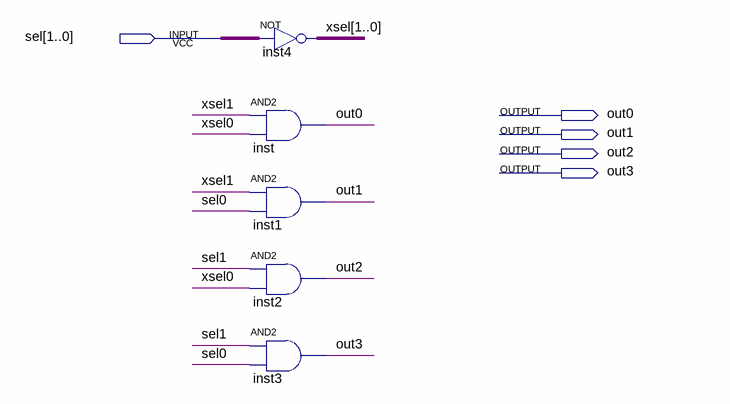
[diagram p0: schematic sheet]
// Quartus schematic pfs_decod2x4.bdf as structural Verilog: 5 symbols, 5 pins
module pfs_decod2x4 (
  input  [1:0] sel,
  output out0,
  output out1,
  output out2,
  output out3
);

  wire [1:0] xsel;

  assign xsel = ~sel;  // NOT inst4, 2 bits wide
  and inst (out0, xsel[1], xsel[0]);
  and inst1 (out1, xsel[1], sel[0]);
  and inst2 (out2, sel[1], xsel[0]);
  and inst3 (out3, sel[1], sel[0]);
endmodule
